# Altium schematic sheet Illustrations 1.SchDoc: Illustrations 1
size A3; ApprovedBy: LD Stanton; Author: LD Stanton; CompanyName: University of Cape Town; DrawnBy: Lawrence Stanton; Engineer: Lawrence Stanton; Organization: University of Cape Town; Address1: Department of Electrical Engineering; Address2: Rondebosch; Address3: Cape Town; Address4: South Africa 7701; DocumentNumber: 18; SheetNumber: 18; SheetTotal: 20
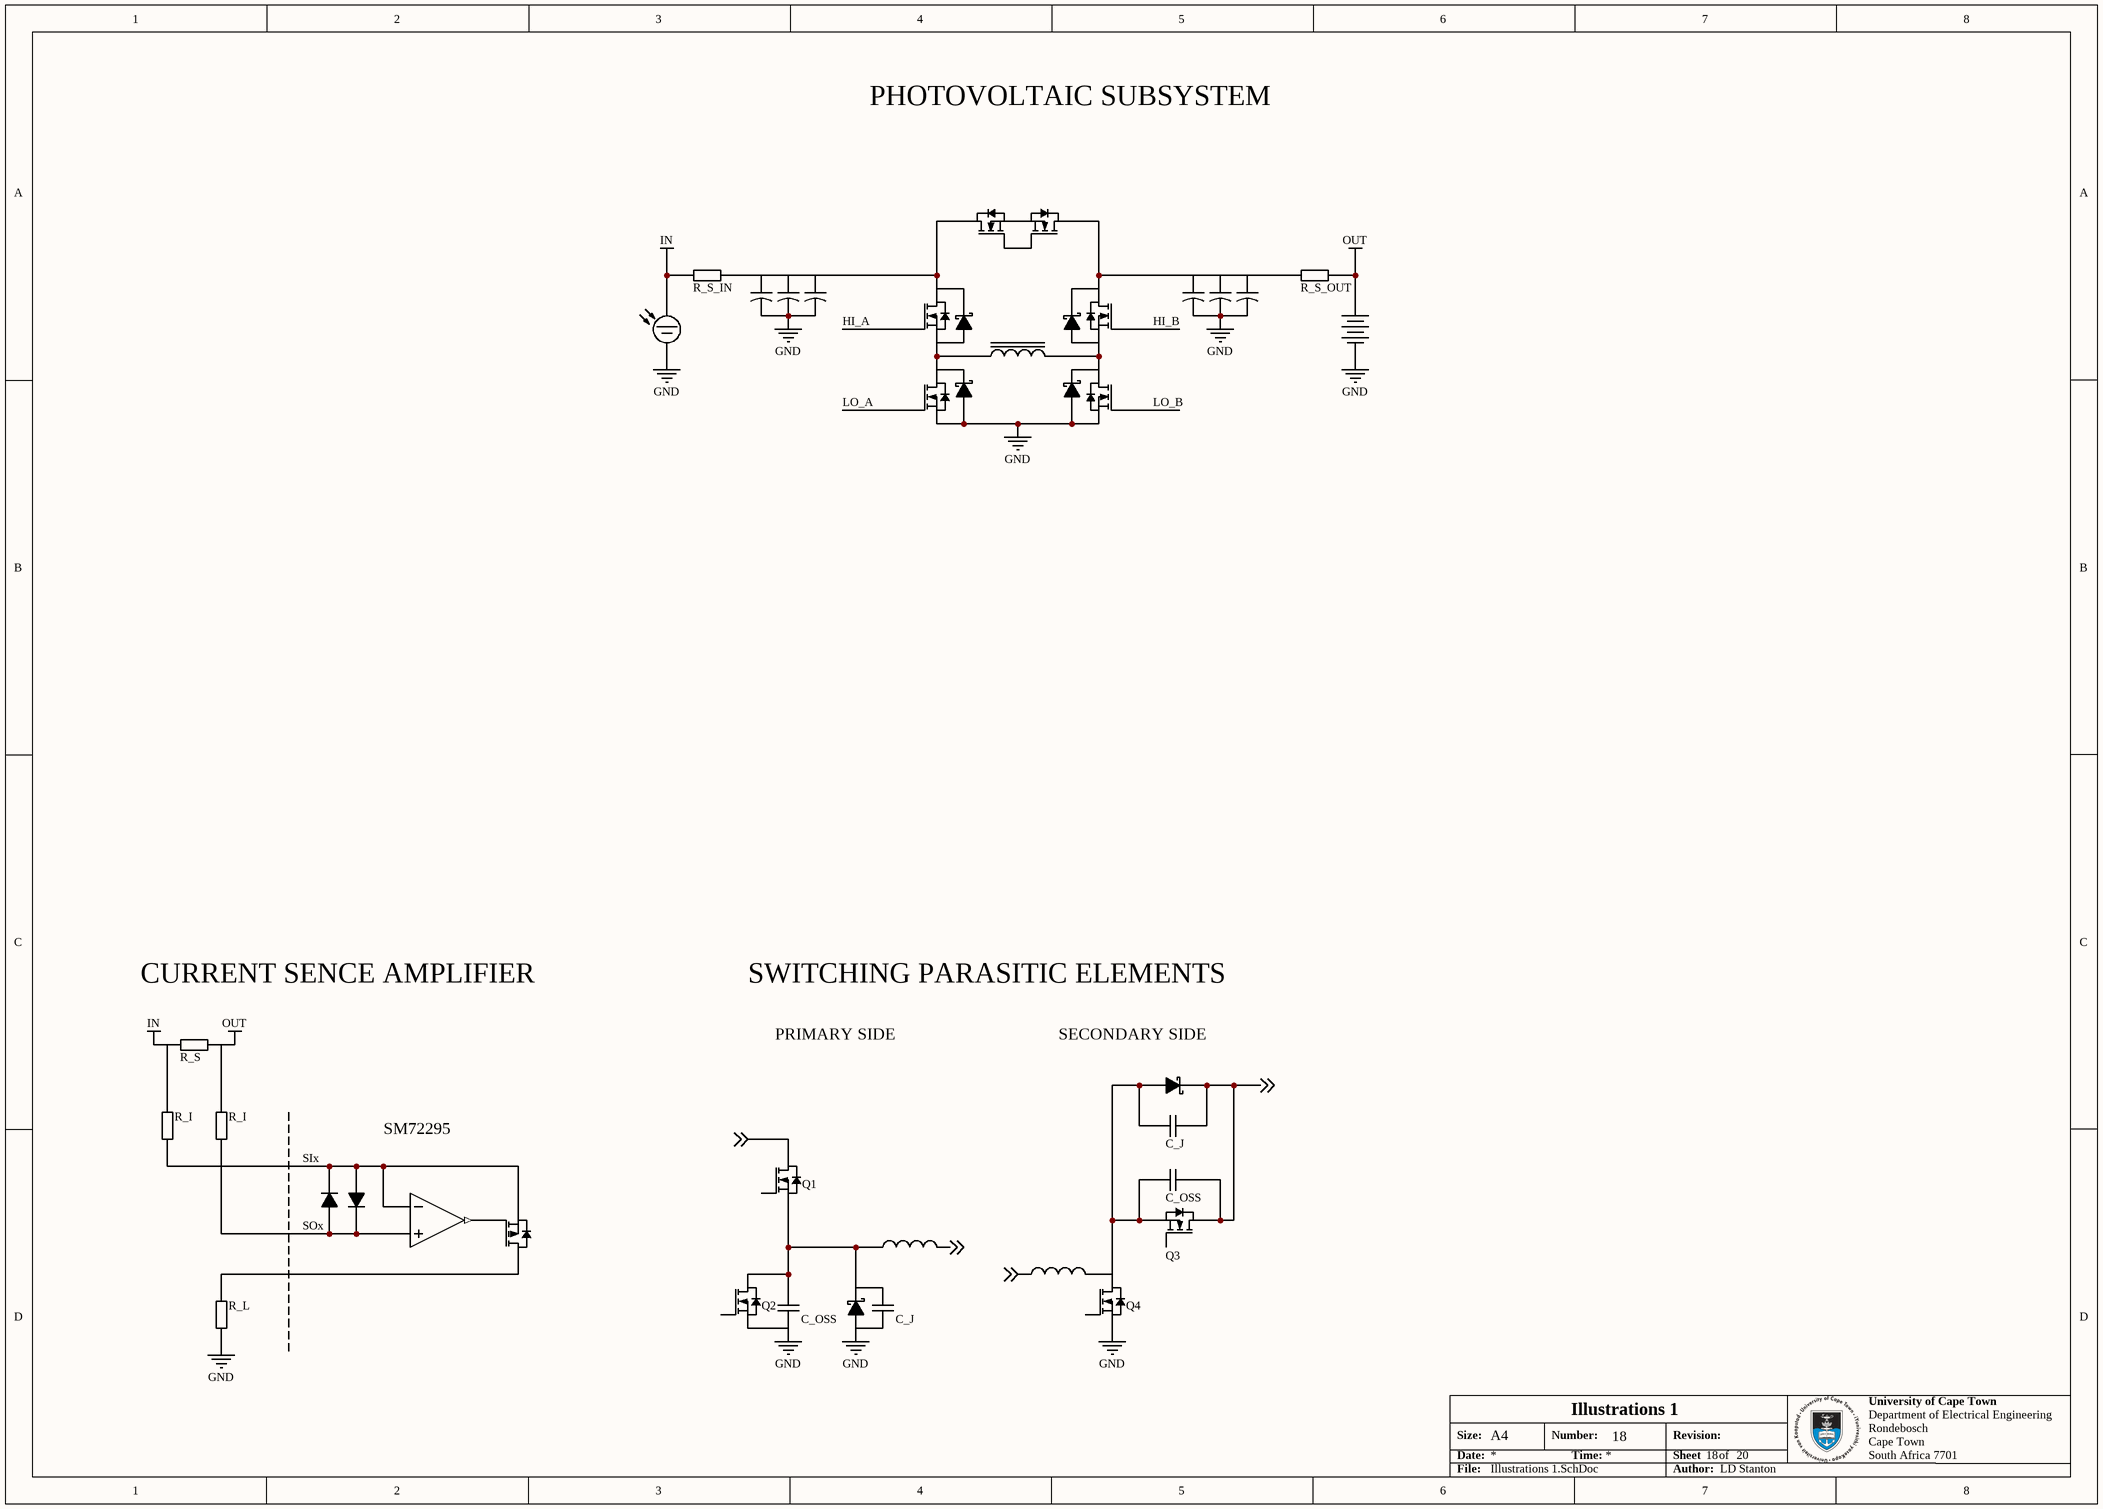
[diagram p0: Illustrations 1.SchDoc]

## Parts
(Parts that share a designator on the sheet are numbered #1, #2 ... from top to bottom, then left to right.)
BT?#1  Photovoltaic Illustration  (value not drawn)  (graphical)
BT?#2  Battery Multicell Illustration  (value not drawn)  (graphical)
C?#1  Capacitor Polarised Illustration  (value not drawn)  (graphical)
C?#2  Capacitor Polarised Illustration  (value not drawn)  (graphical)
C?#3  Capacitor Polarised Illustration  (value not drawn)  (graphical)
C?#4  Capacitor Polarised Illustration  (value not drawn)  (graphical)
C?#5  Capacitor Polarised Illustration  (value not drawn)  (graphical)
C?#6  Capacitor Polarised Illustration  (value not drawn)  (graphical)
C_J#1  Capacitor Non-Polarised Illustration  (value not drawn)  (graphical)
C_J#2  Capacitor Non-Polarised Illustration  (value not drawn)  (graphical)
C_OSS#1  Capacitor Non-Polarised Illustration  (value not drawn)  (graphical)
C_OSS#2  Capacitor Non-Polarised Illustration  (value not drawn)  (graphical)
D?#1  Schottky Diode Illustration  (value not drawn)  (graphical)
D?#2  Schottky Diode Illustration  (value not drawn)  (graphical)
D?#3  Schottky Diode Illustration  (value not drawn)  (graphical)
D?#4  Schottky Diode Illustration  (value not drawn)  (graphical)
D?#5  Schottky Diode Illustration  (value not drawn)  (graphical)
D?#6  Diode Illustration  (value not drawn)  (graphical)
D?#7  Diode Illustration  (value not drawn)  (graphical)
D?#8  Schottky Diode Illustration  (value not drawn)  (graphical)
L?#1  Inductor Core Illustration  (value not drawn)  (graphical)
L?#2  Inductor Illustration  (value not drawn)  (graphical)
L?#3  Inductor Illustration  (value not drawn)  (graphical)
Q1  MOSFET N-Channel Illustration  (value not drawn)  (graphical)
Q2  MOSFET N-Channel Illustration  (value not drawn)  (graphical)
Q3  MOSFET N-Channel Illustration  (value not drawn)  (graphical)
Q4  MOSFET N-Channel Illustration  (value not drawn)  (graphical)
Q?#1  MOSFET N-Channel Illustration  (value not drawn)  (graphical)
Q?#2  MOSFET N-Channel Illustration  (value not drawn)  (graphical)
Q?#3  MOSFET N-Channel Illustration  (value not drawn)  (graphical)
Q?#4  MOSFET N-Channel Illustration  (value not drawn)  (graphical)
Q?#5  MOSFET N-Channel Illustration  (value not drawn)  (graphical)
Q?#6  MOSFET N-Channel Illustration  (value not drawn)  (graphical)
Q?#7  MOSFET P-Channel Illustration  (value not drawn)  (graphical)
R_I#1  Resistor Box Illustration  (value not drawn)  (graphical)
R_I#2  Resistor Box Illustration  (value not drawn)  (graphical)
R_L  Resistor Box Illustration  (value not drawn)  (graphical)
R_S  Resistor Box Illustration  (value not drawn)  (graphical)
R_S_IN  Resistor Box Illustration  (value not drawn)  (graphical)
R_S_OUT  Resistor Box Illustration  (value not drawn)  (graphical)
U?  Op-Amp Unowered Illustration  (value not drawn)  (graphical)

## Nets
GND: BT?#1.2 BT?#2.2 C?#1.2 C?#2.2 C?#3.2 C?#4.2 C?#5.2 C?#6.2 C_J#2.1 C_OSS#2.2 D?#3.2(A) D?#4.2(A) D?#8.2(A) Q2.2(S) Q4.2(S) Q?#5.2(S) Q?#6.2(S) R_L.2
IN: BT?#1.1 R_I#1.1 R_S.1 R_S_IN.1
OUT: BT?#2.1 R_I#2.1 R_S.2 R_S_OUT.1
HI_A: Q?#3.1(G)
HI_B: Q?#4.1(G)
LO_A: Q?#5.1(G)
LO_B: Q?#6.1(G)
NetC?#1_1: C?#1.1 C?#2.1 C?#3.1 D?#1.1(K) Q?#1.3(D) Q?#3.3(D) R_S_IN.2
NetC?#4_1: C?#4.1 C?#5.1 C?#6.1 D?#2.1(K) Q?#2.3(D) Q?#4.3(D) R_S_OUT.2
NetC_J#1_1: C_J#1.1 C_OSS#1.1 D?#5.2(A) L?#3.2 Q3.2(S) Q4.3(D)
NetC_J#1_2: C_J#1.2 C_OSS#1.2 D?#5.1(K) L?#2.2 L?#3.1 Q1.3(D) Q3.3(D) ; off-sheet 
NetC_J#2_2: C_J#2.2 C_OSS#2.1 D?#8.1(K) L?#2.1 Q1.2(S) Q2.3(D)
NetD?#1_2: D?#1.2(A) D?#3.1(K) L?#1.1 Q?#3.2(S) Q?#5.3(D)
NetD?#2_2: D?#2.2(A) D?#4.1(K) L?#1.2 Q?#4.2(S) Q?#6.3(D)
NetD?#6_1: D?#6.1(K) D?#7.2(A) R_I#2.2 U?.2(1IN+)
NetD?#6_2: D?#6.2(A) D?#7.1(K) Q?#7.2(S) R_I#1.2 U?.1(1IN-)
NetQ?#1_1: Q?#1.1(G) Q?#2.1(G)
NetQ?#1_2: Q?#1.2(S) Q?#2.2(S)
NetQ?#7_1: Q?#7.1(G) U?.3(OUT)
NetQ?#7_3: Q?#7.3(D) R_L.1

Not connected (* = marked no-connect by the designer): Q1 1(G); Q2 1(G); Q3 1(G); Q4 1(G)

## Notes on the sheet
- PHOTOVOLTAIC SUBSYSTEM
- CURRENT SENCE AMPLIFIER
- SWITCHING PARASITIC ELEMENTS
- PRIMARY SIDE
- (near D?#5) SECONDARY SIDE
- (near D?#7) SIx
- SM72295
- (near D?#7) SOx
- Size:
- Date:
- A4
- Number:
- Time:
- Revision:
- Sheet
- of
- File:
- Author:

## Library data of the parts
BT?#1 = CMP-000016-2: Solar Cell or Panel for Illustration; Short Circuit Current: 0A; Power: 0W; Open Circuit Voltage: 0V
BT?#2 = CMP-00015-2: Multicell Battery for Illustration; Value: 0A; Placement: CRITICAL
C?#1-C?#6 = CMP-000004-8: Polarised Capacitor for Illustration; Value: 0F; Temperature Coefficient: ±0ppm/K; Tolerance: ±0%; Voltage: 0V; Placement: CRITICAL; Temperature: -0 - 0°C; Package: 0000
C_J#1 C_J#2 C_OSS#1 C_OSS#2 = CMP-000003-10: Non-Polarised Capacitor for Illustration.; Value: 0F; Tolerance: ±0%; Temperature Coefficient: ±0ppm/K; Placement: CRITICAL; Voltage: 0V; Package: 0000; Temperature: -0 - 0°C
D?#1-D?#5 D?#8 = CMP-00003-5: Schottky Diode for Ilustration; Forward Current: 0A0; Placement: CRITICAL; Blocking Voltage: 0V0; Temperature: -0 - 0°C; Forward Voltage: 0V0
D?#6 D?#7 = CMP-00005-4: General Diode for Ilustration; Forward Voltage: 0V0; Placement: CRITICAL; Forward Current: 0A0; Temperature: -0 - 0°C; Blocking Voltage: 0V0
L?#1 = CMP-00048-1: General Inductor with Magnetic Core for Illustration; Value: 0H; Resistance: 0K0; Saturation Current: 0A; Placement: CRITICAL; Temperature Coefficient: ±0ppm/K; Tolerance: ±0%; Temperature: -0 - 0°C; Rated Current: 0A
L?#2 L?#3 = CMP-000009-4: General Inductor for Illustration; Value: 0H; Rated Current: 0A; Tolerance: ±0%; Temperature Coefficient: ±0ppm/K; Placement: CRITICAL; Resistance: 0K0; Temperature: -0 - 0°C; Saturation Current: 0A
Q1-Q4 Q?#1-Q?#6 = CMP-000008-5: N-Channel MOSFET 3-Terminal for Illustration; Current: 0A; Gate Threshold Voltage: 0V; Placement: CRITICAL; Temperature: -0 - 0°C; Gate-Source Voltage: 0V; Drain-Source Voltage: 0V
Q?#7 = CMP-00001-3: P-Channel MOSFET 3-Terminal for Illustration; Drain-Source Voltage: 0V; Current: 0A; Placement: CRITICAL; Gate-Source Voltage: 0V; Gate Threshold Voltage: 0V; Temperature: -0 - 0°C
R_I#1 R_I#2 R_L R_S R_S_IN R_S_OUT = CMP-010-000360-14: Resistor for Illustration. Box Symbol.; Value: 0K0; Working Voltage: 0V; Power: 0W; Placement: CRITICAL; Tolerance: ±0%; Temperature Coefficient: ±0ppm/K; Package: 0000; Temperature: -0 - 0°C
U? = CMP-00064-1: Operational Amplifier without Power Pins for Illustration; Placement: CRITICAL; Temperature: -0 - 0°C